# EAGLE schematic od1 (EAGLE 9.6.0)
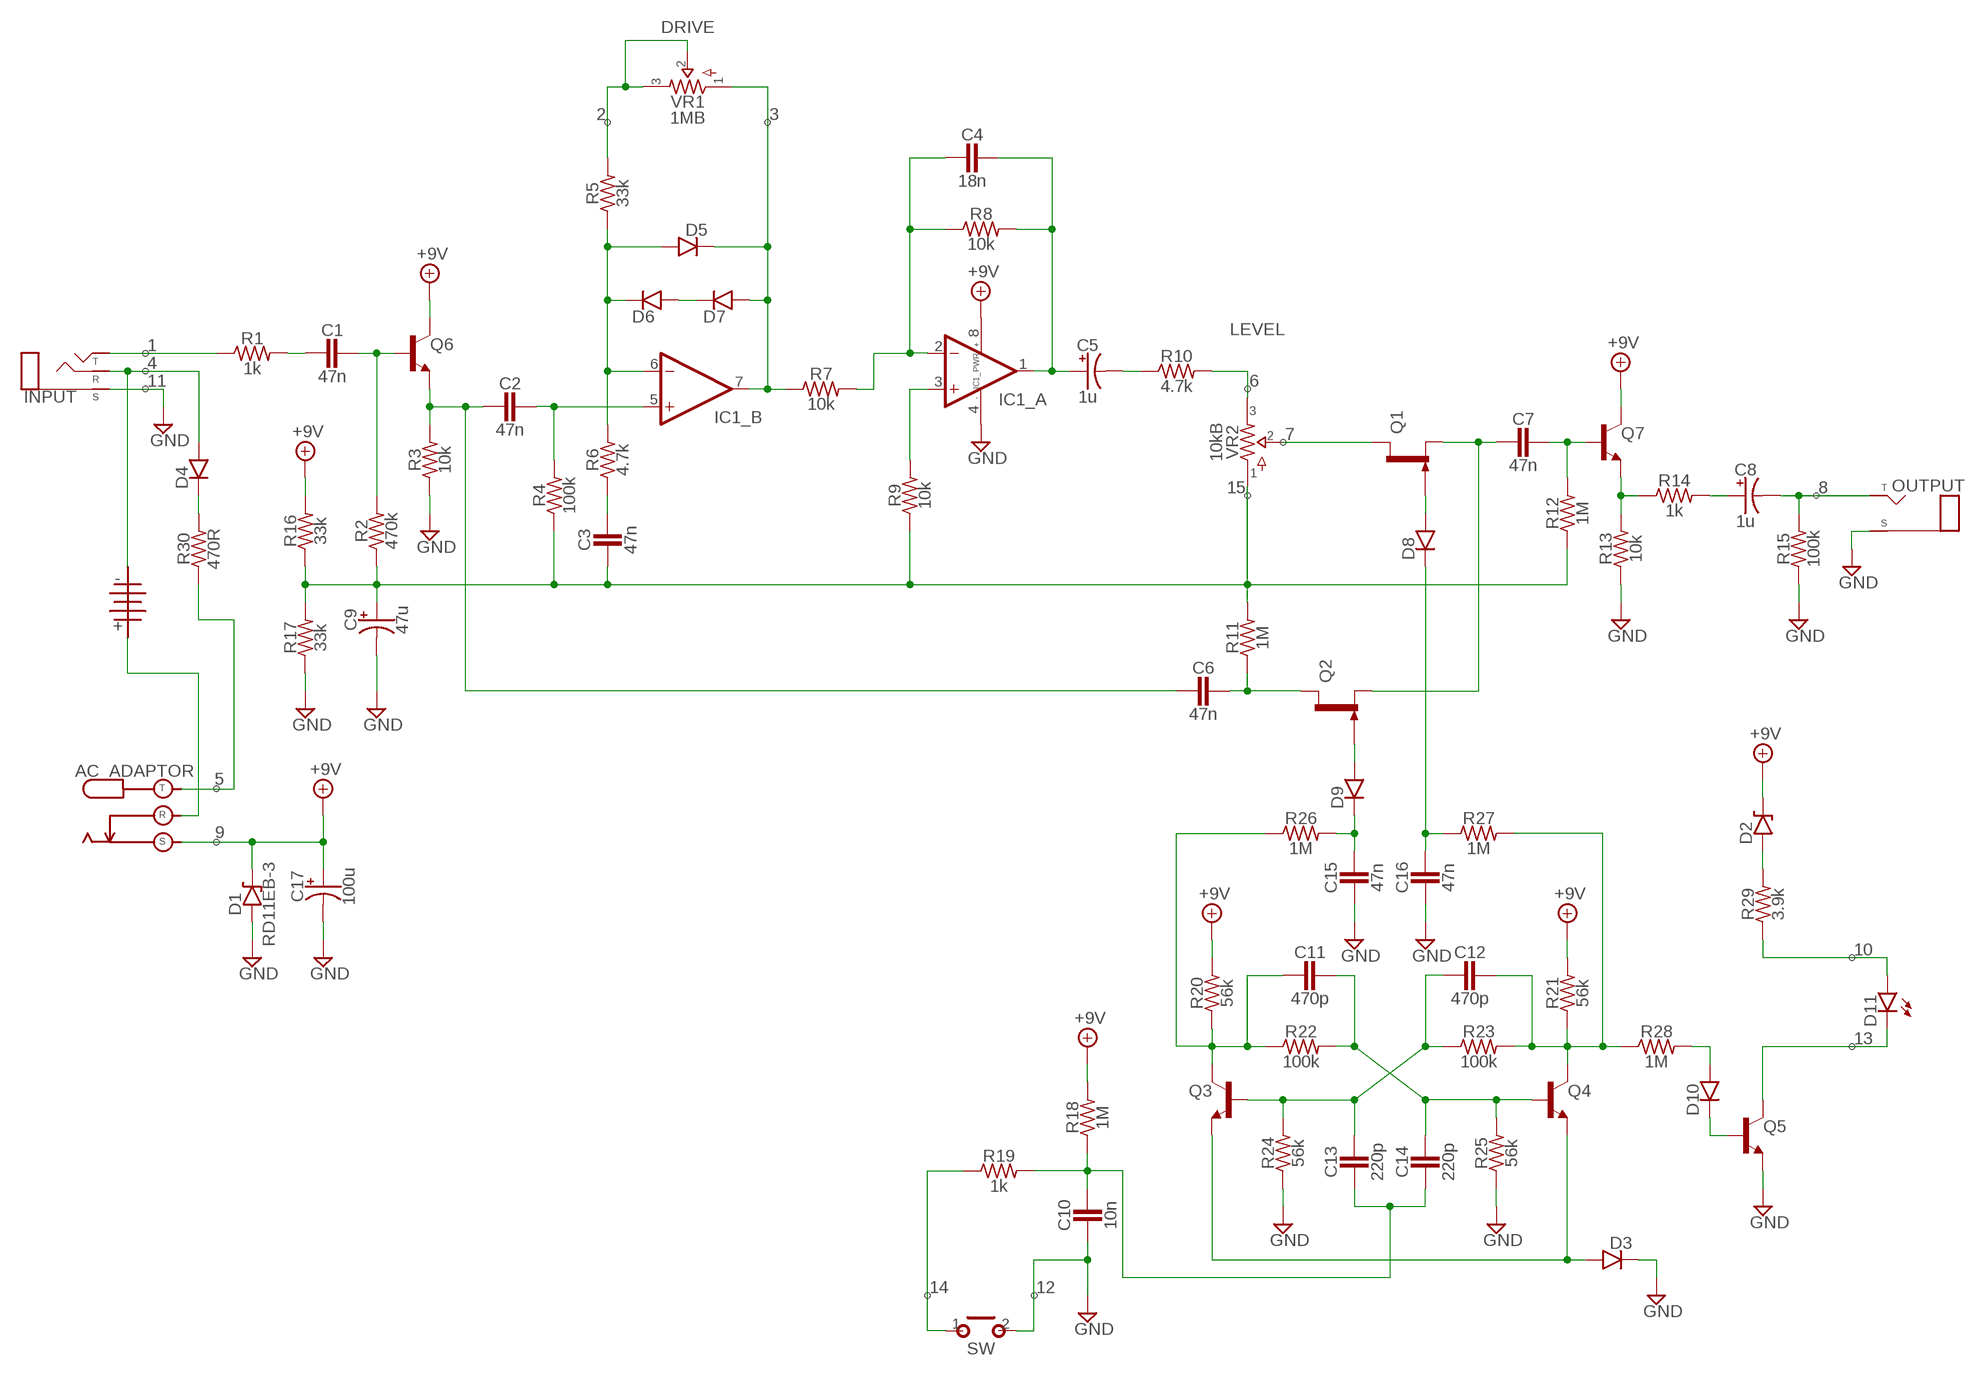
[diagram p0: schematic, sheet 1]

## Parts
1101  BATTERY  [TWO_PADS]
AC_ADAPTOR  DC_KOBICONN  [DC_KOBICONN]
C1  47n  CER/FILMBOX.1  [BOX_SMALL]
C2  47n  CER/FILMBOX.1  [BOX_SMALL]
C3  47n  CER/FILMBOX.1  [BOX_SMALL]
C4  18n  CER/FILMBOX.1  [BOX_SMALL]
C5  1u  0400  [040_020]
C6  47n  CER/FILMBOX.1  [BOX_SMALL]
C7  47n  CER/FILMBOX.1  [BOX_SMALL]
C8  1u  0400  [040_020]
C9  47u  0400  [040_020]
C10  10n  CER/FILMBOX.1  [BOX_SMALL]
C11  470p  CER/FILMBOX.1  [BOX_SMALL]
C12  470p  CER/FILMBOX.1  [BOX_SMALL]
C13  220p  CER/FILMBOX.1  [BOX_SMALL]
C14  220p  CER/FILMBOX.1  [BOX_SMALL]
C15  47n  CER/FILMBOX.1  [BOX_SMALL]
C16  47n  CER/FILMBOX.1  [BOX_SMALL]
C17  100u  0400  [040_020]
D1  RD11EB-3  ZENER.2  [DO41-2]
D2  ZENER.2  [DO41-2]
D3  DO35.2  [DO35-2]
D4  DO35.2  [DO35-2]
D5  DO35.2  [DO35-2]
D6  DO35.2  [DO35-2]
D7  DO35.2  [DO35-2]
D8  DO35.2  [DO35-2]
D9  DO35.2  [DO35-2]
D10  DO35.2  [DO35-2]
D11  SLP1358  LED  [3MM_D]
IC1  DUALTH  [DIL0]
INPUT  STEREO3PADS  [THREEPADS]
OUTPUT  MONO  [TWO_PADS]
Q1  2N5457  [TO92-]
Q2  2N5457  [TO92-]
Q3  2SC828A  [TO92-]
Q4  2SC828A  [TO92-]
Q5  2SC828A  [TO92-]
Q6  2SC828A  [TO92-]
Q7  2SC828A  [TO92-]
R1  1k  R_.3B  [R0207/3]
R2  470k  R_.3B  [R0207/3]
R3  10k  R_.3B  [R0207/3]
R4  100k  R_.3B  [R0207/3]
R5  33k  R_.3B  [R0207/3]
R6  4.7k  R_.3B  [R0207/3]
R7  10k  R_.3B  [R0207/3]
R8  10k  R_.3B  [R0207/3]
R9  10k  R_.3B  [R0207/3]
R10  4.7k  R_.3B  [R0207/3]
R11  1M  R_.3B  [R0207/3]
R12  1M  R_.3B  [R0207/3]
R13  10k  R_.3B  [R0207/3]
R14  1k  R_.3B  [R0207/3]
R15  100k  R_.3B  [R0207/3]
R16  33k  R_.3B  [R0207/3]
R17  33k  R_.3B  [R0207/3]
R18  1M  R_.3B  [R0207/3]
R19  1k  R_.3B  [R0207/3]
R20  56k  R_.3B  [R0207/3]
R21  56k  R_.3B  [R0207/3]
R22  100k  R_.3B  [R0207/3]
R23  100k  R_.3B  [R0207/3]
R24  56k  R_.3B  [R0207/3]
R25  56k  R_.3B  [R0207/3]
R26  1M  R_.3B  [R0207/3]
R27  1M  R_.3B  [R0207/3]
R28  1M  R_.3B  [R0207/3]
R29  3.9k  R_.3B  [R0207/3]
R30  470R  R_.3B  [R0207/3]
SW  MOMENTARY  [SPST]
VR1  1MB  POTS16MM  [16MM]
VR2  10kB  POTS16MM  [16MM]

## Nets
+9V: AC_ADAPTOR.S C17.+ D1.C D2.C IC1.8(_PWR:V+) Q6.2(C) Q7.2(C) R16.2 R18.2 R20.2 R21.2
GND: C9.- C10.2 C15.2 C16.2 C17.- D1.A D3.C IC1.4(_PWR:V-) INPUT.SLEEVE(S) OUTPUT.S(SLEEVE) Q5.3(E) R3.1 R13.1 R15.1 R17.1 R24.1 R25.1 SW.2(S)
N$1: INPUT.TIP(T) R1.1
N$2: 1101.S D4.A INPUT.RING(R)
N$3: C1.2 R1.2
N$4: C1.1 Q6.1(B) R2.2
N$5: D5.A D6.C IC1.6(_B:-IN) R5.1 R6.2
N$6: C3.2 C9.+ R2.1 R4.1 R9.1 R11.2 R12.1 R16.1 R17.2 VR2.1
N$7: C2.2 C6.2 Q6.3(E) R3.2
N$8: C2.1 IC1.5(_B:+IN) R4.2
N$9: C3.1 R6.1
N$10: D6.A D7.C
N$11: D5.C D7.A IC1.7(_B:OUT) R7.1 VR1.1
N$12: R5.2 VR1.2 VR1.3
N$13: IC1.3(_A:+IN) R9.2
N$14: C4.2 IC1.2(_A:-IN) R7.2 R8.1
N$15: C4.1 C5.+ IC1.1(_A:OUT) R8.2
N$16: D11.P$1(C) Q5.2(C)
N$17: D3.A Q3.3(E) Q4.3(E)
N$18: C5.- R10.1
N$19: R10.2 VR2.3
N$20: Q1.3(D) VR2.2
N$21: D10.A R28.2
N$22: C7.2 Q1.2(S) Q2.2(S)
N$23: C7.1 Q7.1(B) R12.2
N$24: Q7.3(E) R13.2 R14.1
N$25: C8.+ R14.2
N$26: C8.- OUTPUT.T(TIP) R15.2
N$27: 1101.T AC_ADAPTOR.R
N$28: AC_ADAPTOR.T R30.1
N$29: C11.2 Q3.2(C) R20.1 R22.1 R26.1
N$30: D4.C R30.2
N$31: C12.1 Q4.2(C) R21.1 R23.2 R27.2 R28.1
N$32: C12.2 C13.1 Q3.1(B) R23.1 R24.2
N$33: D10.C Q5.1(B)
N$34: C11.1 C14.1 Q4.1(B) R22.2 R25.2
N$35: C15.1 D9.C R26.2
N$36: C10.1 C13.2 C14.2 R18.1 R19.2
N$37: C16.1 D8.C R27.1
N$38: R19.1 SW.1(P)
N$39: D9.A Q2.1(G)
N$40: D8.A Q1.1(G)
N$41: C6.1 Q2.3(D) R11.1
N$42: D11.ANODE(A) R29.1
N$43: D2.A R29.2

## Notes on the sheet
- DRIVE
- 2 | 3
- LEVEL
- 1
- 4
- 11 | 6
- 7
- 15 | 8
- 5
- 9
- 10
- 13
- 14 | 12

## Library data of the parts
1101 = pedals-jacks:BATTERY
AC_ADAPTOR = pedals-jacks:DC_KOBICONN
C1-C4 C6 C7 C10-C16 = pedals-capacitors-film:CER/FILM: 47 - 120pF Xicon Ceramic Disc 2.5mm lead spacing
C5 C8 C9 C17 = pedals-capacitors-elec:040
D1 D2 = pedals-diodes:ZENER
D3-D10 = pedals-diodes:DO35: DO-35 Package Diodes: 1N914
D11 = pedals-diodes:LED
IC1 = pedals-integrated circuits:DUAL: OP AMP
INPUT = pedals-jacks:STEREO
OUTPUT = pedals-jacks:MONO: Mono 1/4" Phone Jack
Q1 Q2 = pedals-transistors:2N5457: N-CHANNEL JFET
Q3-Q7 = pedals-transistors:2SC828A
R1-R30 = pedals-resistors:R_
SW = pedals-switches:MOMENTARY
VR1 VR2 = pedals-potentiometers:POTS